# EAGLE schematic GankenKunCircuit (EAGLE 6.6.0)
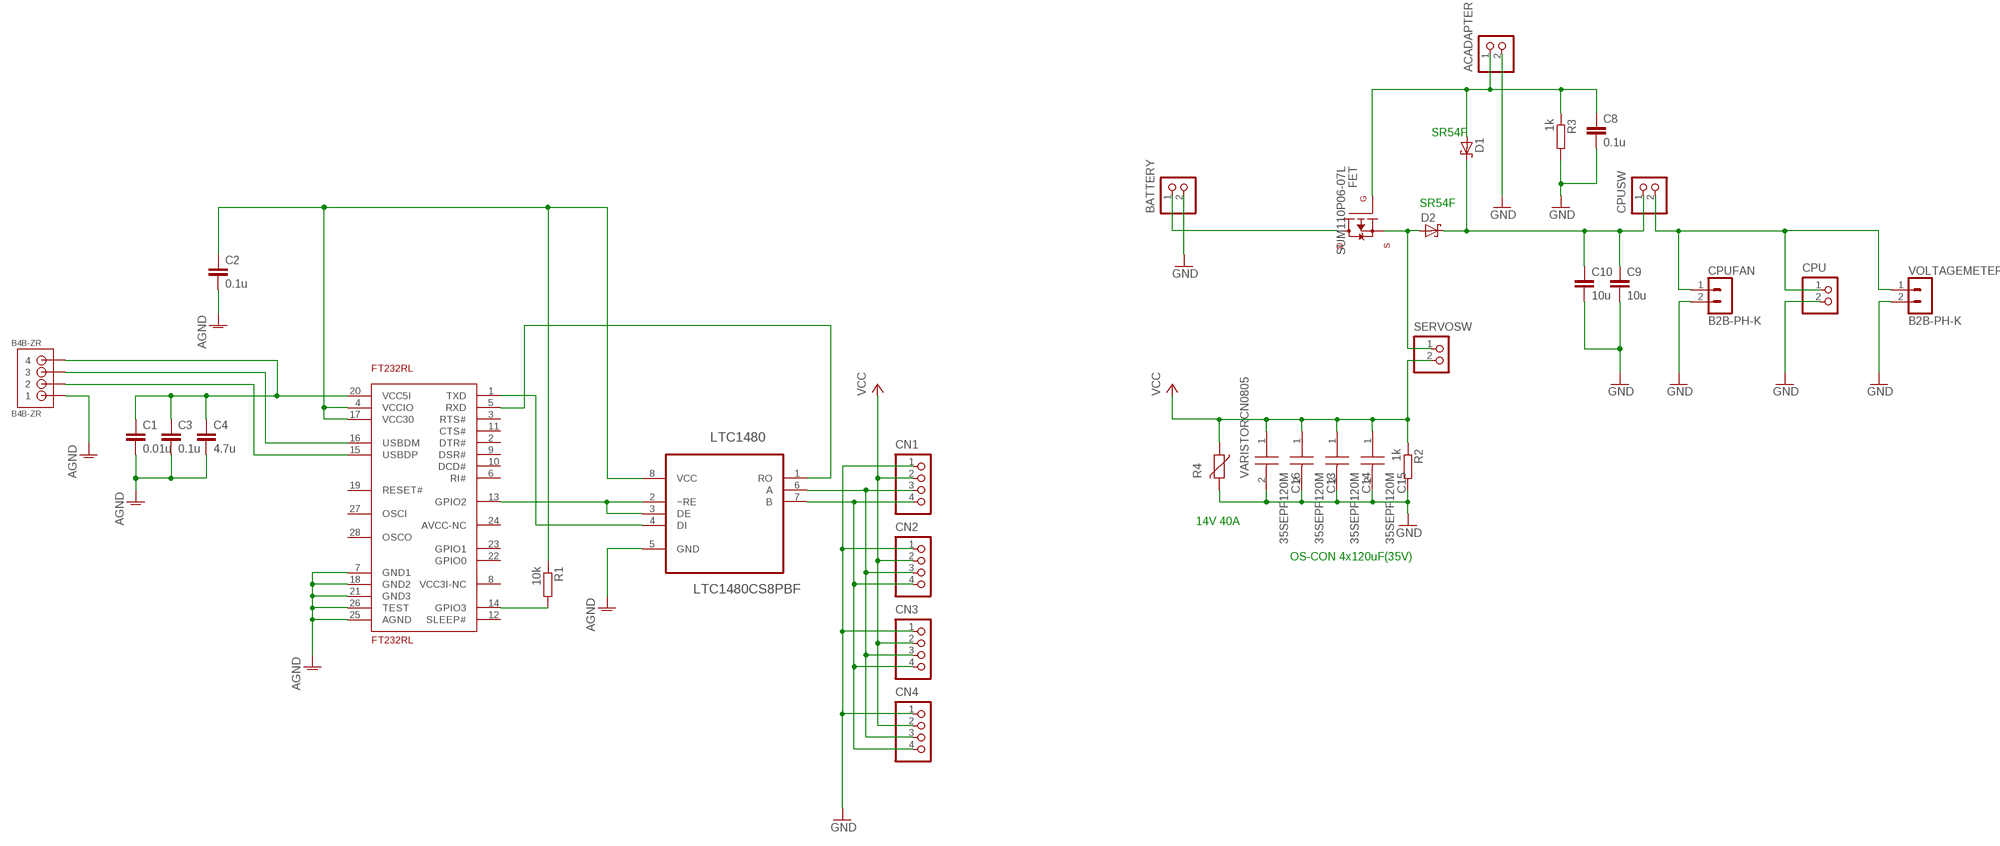
[diagram p0: schematic, sheet 1]

## Parts
ACADAPTER  B2B-XH-A  [B2B-XH-A]
B4B-ZR  B4B-ZR  [B4B-ZR]
BATTERY  B2P-VH  [B2P-VH]
C1  0.01u  C-EUC2012  [C2012]
C2  0.1u  C-EUC2012  [C2012]
C3  0.1u  C-EUC2012  [C2012]
C4  4.7u  C-EUC2012  [C2012]
C8  0.1u  C-EUC2012  [C2012]
C9  10u  C-EUC3216  [C3216]
C10  10u  C-EUC3216  [C3216]
C13  35SEPF120M  [CAPPRD500W65D1000H1350]
C14  35SEPF120M  [CAPPRD500W65D1000H1350]
C15  35SEPF120M  [CAPPRD500W65D1000H1350]
C16  35SEPF120M  [CAPPRD500W65D1000H1350]
CN1  B4B-XH-A  [B4B-XH-A]
CN2  B4B-XH-A  [B4B-XH-A]
CN3  B4B-XH-A  [B4B-XH-A]
CN4  B4B-XH-A  [B4B-XH-A]
CPU  B2B-XH-A  [B2B-XH-A]
CPUFAN  B2B-PH-K  [B2B-PH-K]
CPUSW  B2B-XH-A  [B2B-XH-A]
D1  SCHOTTKY-DIODESMD  [SMB]
D2  SCHOTTKY-DIODESMD  [SMB]
FET  SUM110P06-07L  [TO-263-2]
FT232RL  FT232RL  [SSOP28]
LTC1480  LTC1480CS8PBF  [SOIC127P600X175-8N]
R1  10k  R-EU_M2012  [M2012]
R2  1k  R-EU_M2012  [M2012]
R3  1k  R-EU_M2012  [M2012]
R4  VARISTORCN0805  [CT/CN0805]
SERVOSW  B2P-VH  [B2P-VH]
VOLTAGEMETER  B2B-PH-K  [B2B-PH-K]

## Nets
AGND: B4B-ZR.1 C1.2 C2.2 C3.2 C4.2 FT232RL.7(GND1) FT232RL.18(GND2) FT232RL.21(GND3) FT232RL.25(AGND) FT232RL.26(TEST) LTC1480.5(GND)
GND: ACADAPTER.2 BATTERY.2 C8.2 C9.2 C10.2 C13.2(-) C14.2(-) C15.2(-) C16.2(-) CN1.1 CN2.1 CN3.1 CN4.1 CPU.2 CPUFAN.2 R2.2 R3.2 R4.2 VOLTAGEMETER.2
N$1: C2.1 FT232RL.4(VCCIO) FT232RL.17(VCC30) LTC1480.8(VCC) R1.1
N$2: B4B-ZR.4 C1.1 C3.1 C4.1 FT232RL.20(VCC5I)
N$3: FT232RL.14(GPIO3) R1.2
N$4: B4B-ZR.3 FT232RL.16(USBDM)
N$5: B4B-ZR.2 FT232RL.15(USBDP)
N$6: CN1.4 CN2.4 CN3.4 CN4.4 LTC1480.7(B)
N$7: FT232RL.1(TXD) LTC1480.4(DI)
N$8: FT232RL.5(RXD) LTC1480.1(RO)
N$9: FT232RL.13(GPIO2) LTC1480.2(~RE) LTC1480.3(DE)
N$10: CN1.3 CN2.3 CN3.3 CN4.3 LTC1480.6(A)
N$12: BATTERY.1 FET.4(D)
N$13: D2.A FET.3(S) SERVOSW.1
N$15: C9.1 C10.1 CPUSW.1 D1.C D2.C
N$16: ACADAPTER.1 C8.1 D1.A FET.1(G) R3.1
N$18: CPU.1 CPUFAN.1 CPUSW.2 VOLTAGEMETER.1
VCC: C13.1(+) C14.1(+) C15.1(+) C16.1(+) CN1.2 CN2.2 CN3.2 CN4.2 R2.1 R4.1 SERVOSW.2
Unconnected: FT232RL.2(DTR#) FT232RL.3(RTS#) FT232RL.6(RI#) FT232RL.8(VCC3I-NC) FT232RL.9(DSR#) FT232RL.10(DCD#) FT232RL.11(CTS#) FT232RL.12(SLEEP#) FT232RL.19(RESET#) FT232RL.22(GPIO0) FT232RL.23(GPIO1) FT232RL.24(AVCC-NC) FT232RL.27(OSCI) FT232RL.28(OSCO)

## Notes on the sheet
- SR54F
- SR54F
- 14V 40A
- OS-CON 4x120uF(35V)

## Library data of the parts
ACADAPTER CPU CPUSW = jst-xh:B2B-XH-A: Wire-to-Board 2.5mm pitch top mount connector Source: http://www.jst-mfg.com/product/pdf/jpn/XH.pdf http://www.jst-mfg.com/product/detail.php?series=277
B4B-ZR = jst:B4B-ZR: JST-ZH Connector 4 pol, 1.5mm pitch Package: B4B-ZR Source: http://www.jst-mfg.com/product/pdf/eng/eZH.pdf
BATTERY SERVOSW = jst-vh:B2P-VH: Wire-to-Board 3.96mm pitch top mount connector Source: http://www.jst-mfg.com/product/pdf/jpn/VH.pdf http://www.jst-mfg.com/product/detail.php?series=262
C1-C4 C8-C10 = rcl:C-EU: CAPACITOR, European symbol
C13-C16 = 35SEPF120M:35SEPF120M: Panasonic 120uF 35 V dc Polymer Aluminium Capacitor F13, OS-CON Series 5000h 10 x 13mm Source: Datasheet <https://industrial.panasonic.com/cdbs/www-data/pdf/AAB8000/AAB8000C252.pdf>; DESCRIPTION: Panasonic 120uF 35 V dc Polymer Aluminium Capacitor F13, OS-CON Series 5000h 10 x 13mm; HEIGHT: 13.5mm; MANUFACTURER_NAME: Panasonic; MANUFACTURER_PART_NUMBER: 35SEPF120M; MOUSER_PART_NUMBER: 667-35SEPF120M; MOUSER_PRICE-STOCK: https://www.mouser.com/Search/Refine.aspx?Keyword=667-35SEPF120M; RS_PART_NUMBER: 1000082; RS_PRICE-STOCK: http://uk.rs-online.com/web/p/products/1000082
CN1-CN4 = jst-xh:B4B-XH-A: Wire-to-Board 2.5mm pitch top mount connector Source: http://www.jst-mfg.com/product/pdf/jpn/XH.pdf http://www.jst-mfg.com/product/detail.php?series=277
CPUFAN VOLTAGEMETER = jst-ph:B2B-PH-K: HEADER
D1 D2 = diode:SCHOTTKY-DIODE: Schottky Diode
FET = SUM110P06-07L:SUM110P06-07L; AVAILABILITY: Unavailable; MF: Vishay; MP: SUM110P06-07L; PACKAGE: None; PRICE: None
FT232RL = FT232RL:FT232RL; AVAILABILITY: Good; DESCRIPTION: USB-to-UART 1-CH 256Byte FIFO 5V 28-Pin SSOP; MF: FTDI; MP: FT232RL; PACKAGE: None; PRICE: 8.94 USD
LTC1480 = LTC1480CS8PBF:LTC1480CS8PBF: 3.3V Ultralow Power RS485 Transceiver; AVAILABILITY: Unavailable; DESCRIPTION: RS485 Interface package: SO-8 manufacturer: Linear Technologie; MF: Linear Technology/Analog; MP: LTC1480CS8#PBF; PACKAGE: SO-8 Linear Technology; PRICE: None
R1-R3 = resistor:R-EU_: RESISTOR, European symbol
R4 = varistor:VARISTOR: VARISTOR